# EAGLE board WS2812-Ring_v100 (EAGLE 6.5.0)
CIRCULAR-LAYOUT-SETTINGS: 0.000000 0.000000 3.039370 0.000000 0 1
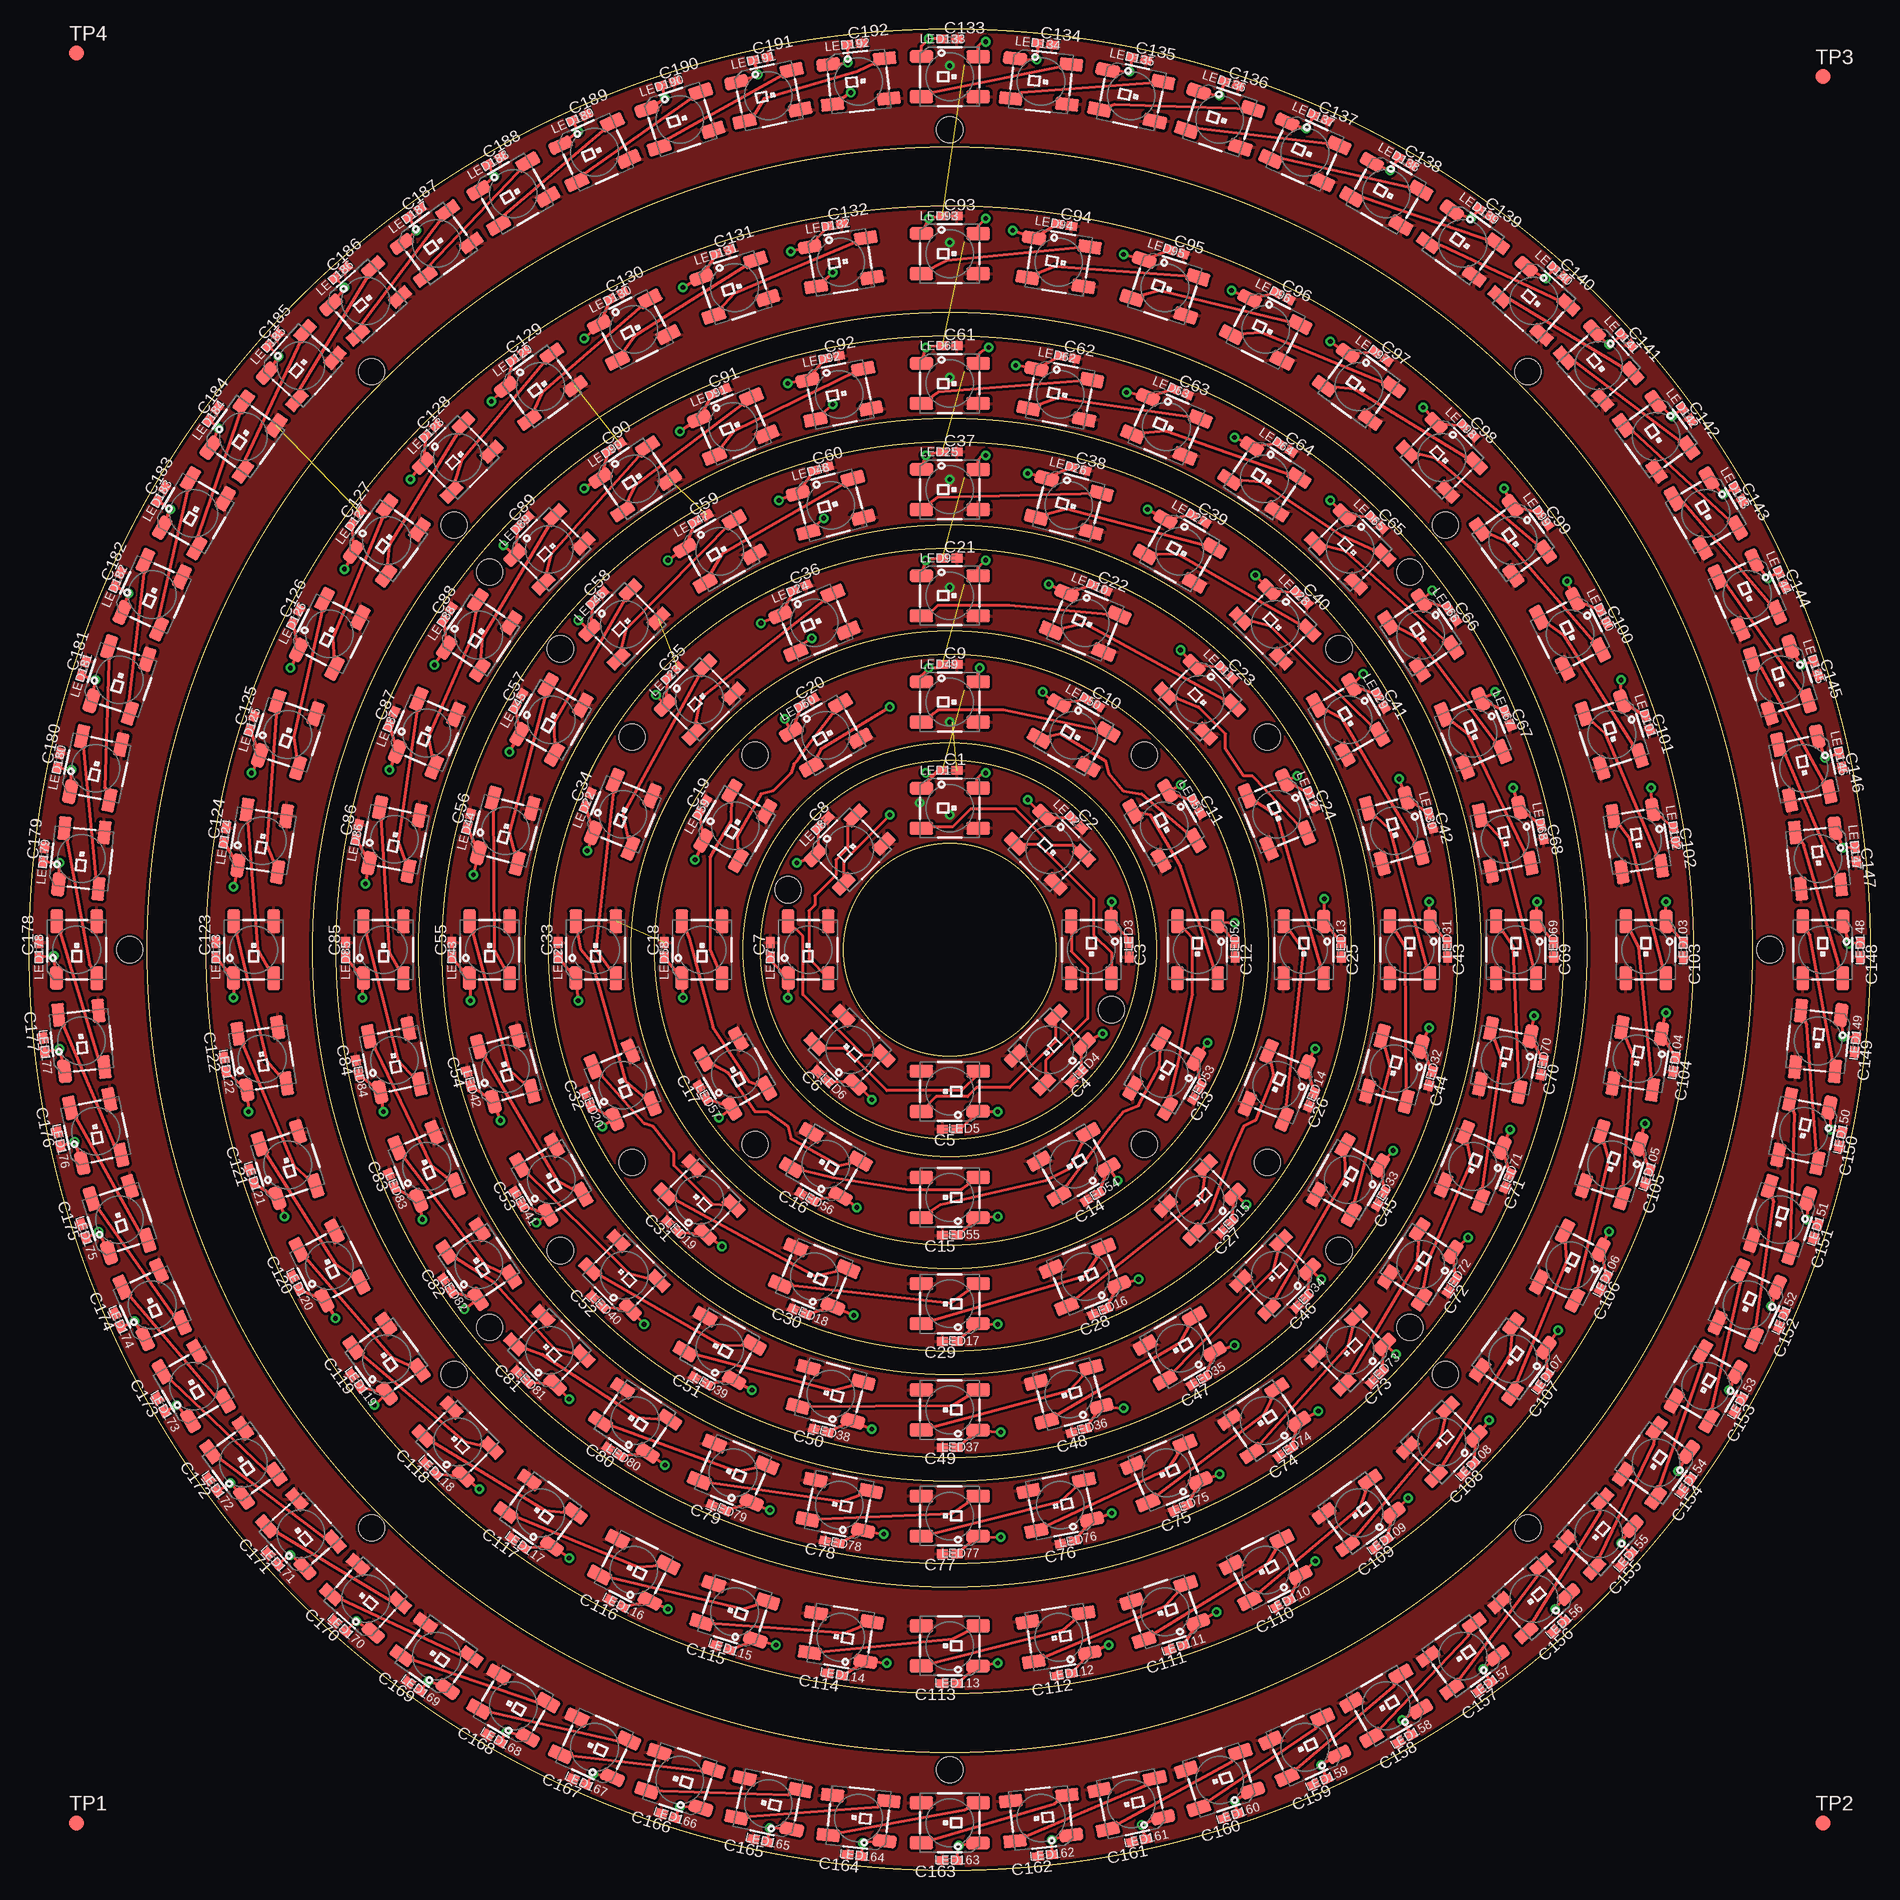
[diagram p2: board, top side]
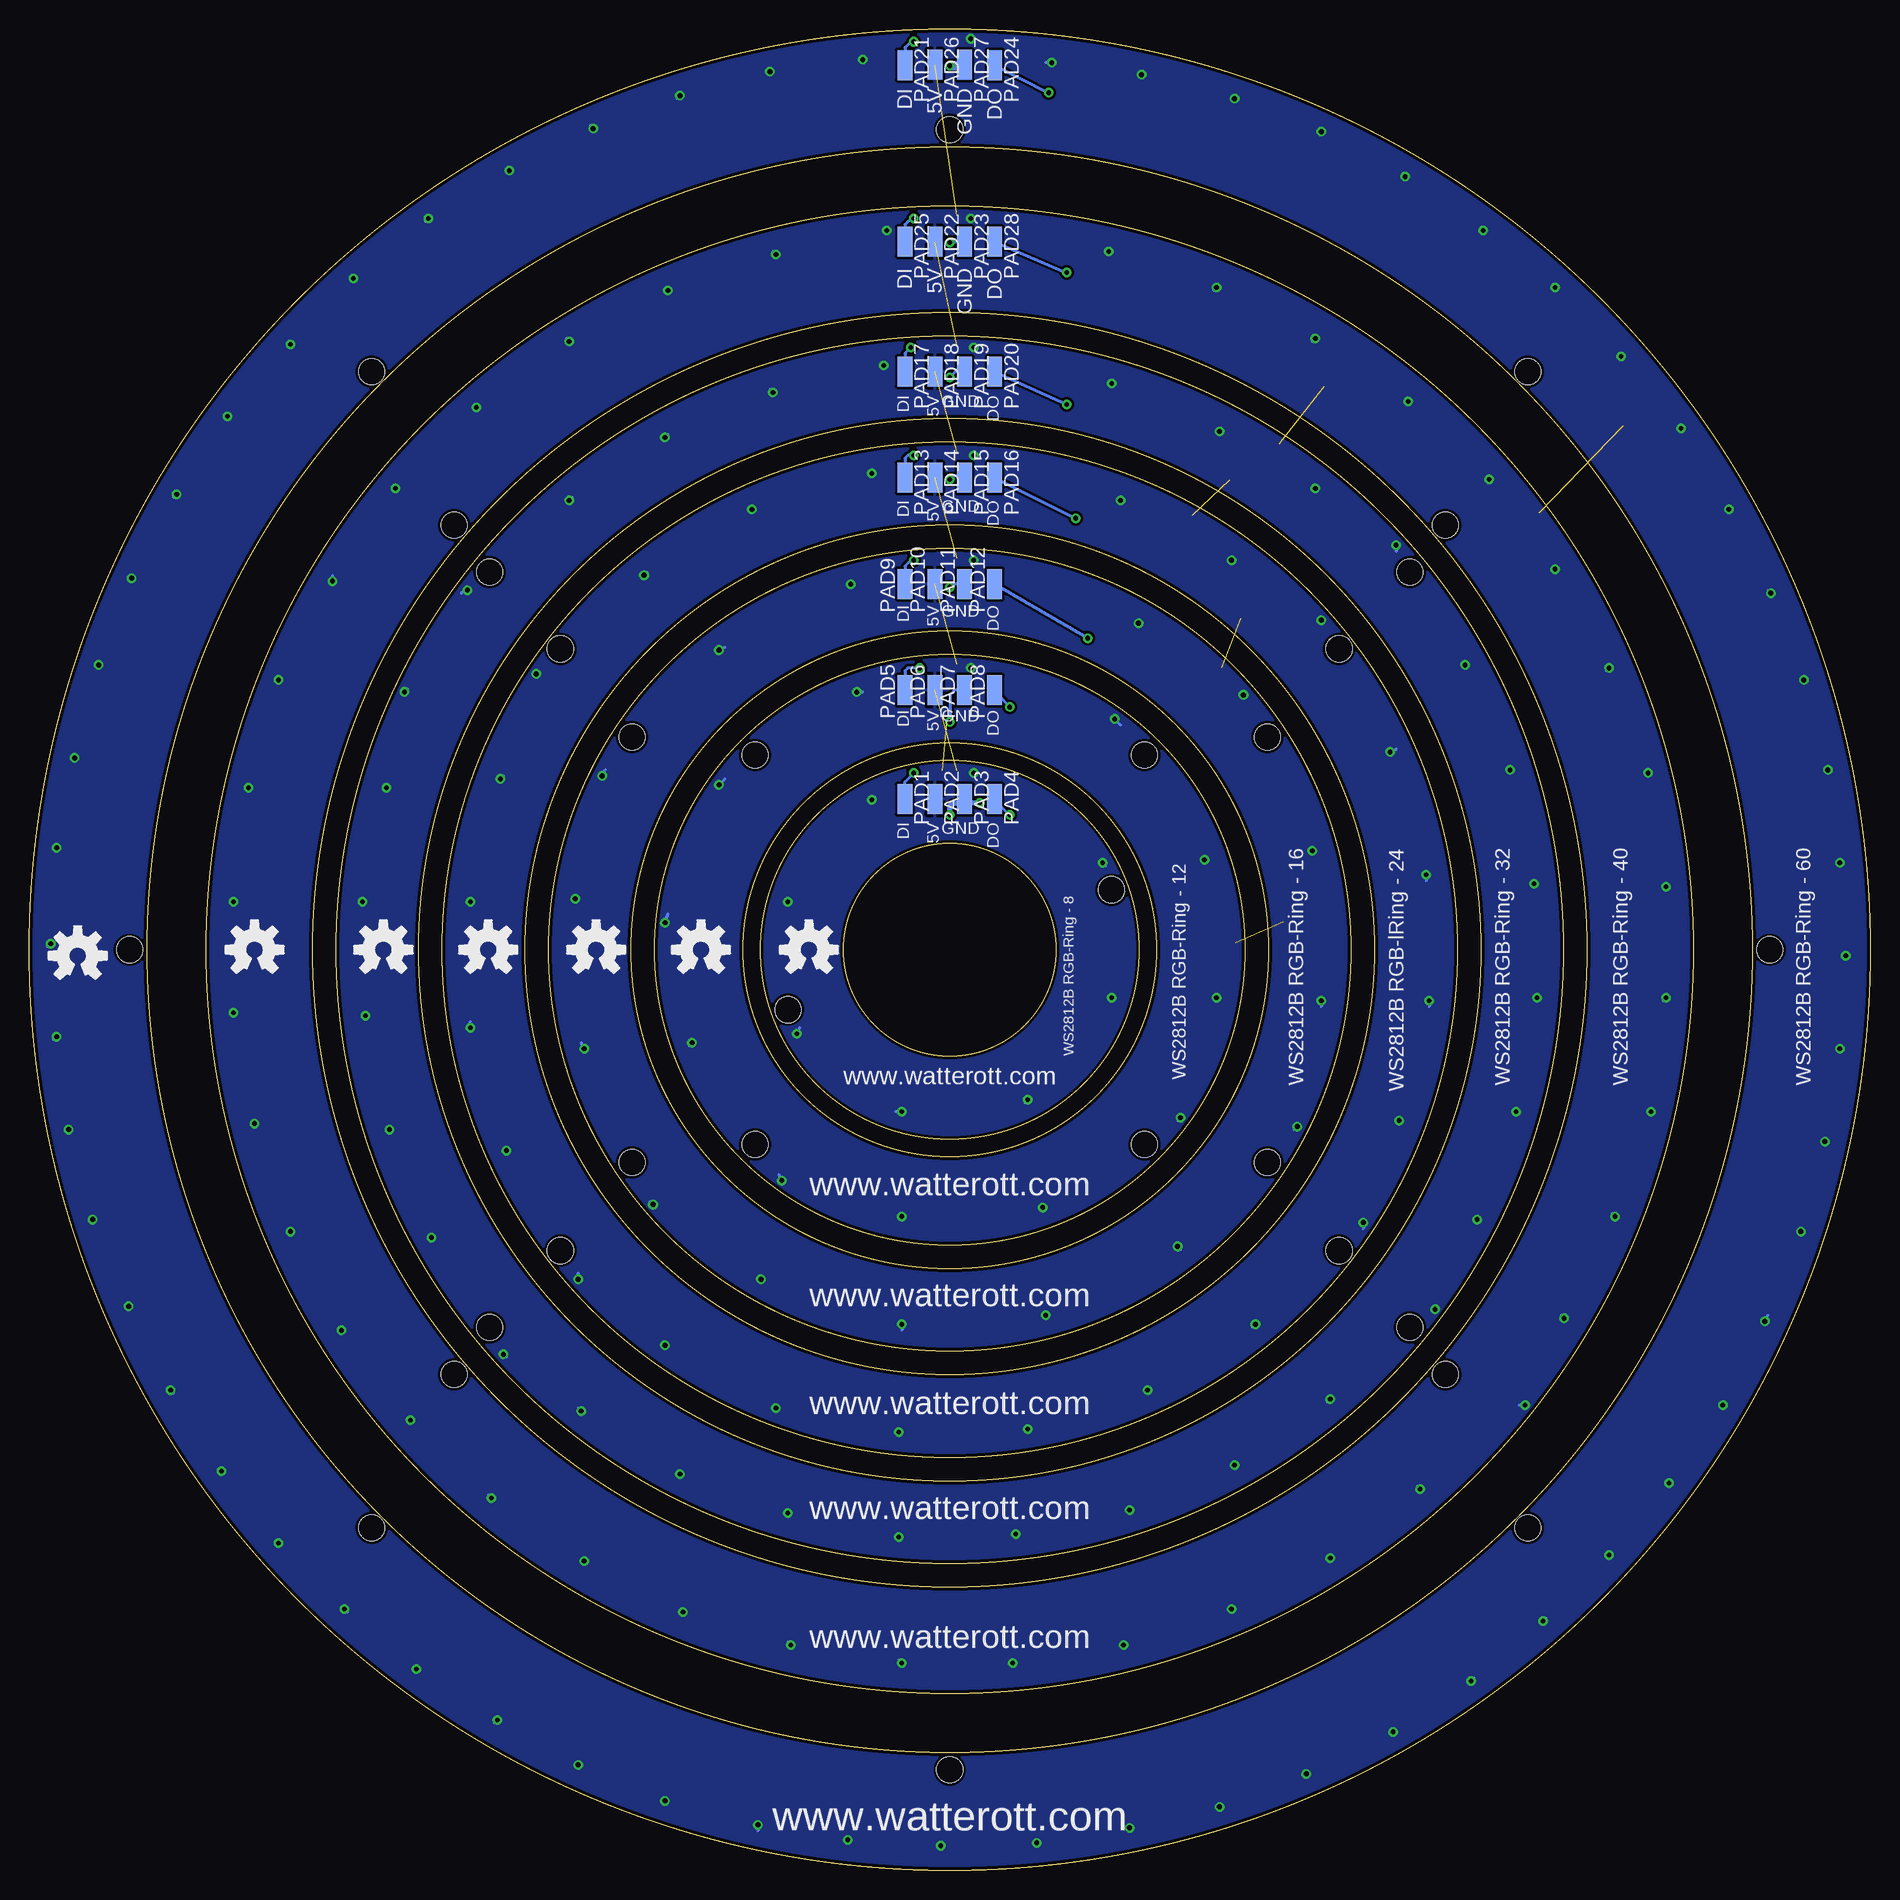
[diagram p3: board, bottom side, seen from below]

Size 156 x 156 mm. Coordinates in mm from the lower left corner, seen from the top.
Outline: circle at 78,78 radius 25
Outline: circle at 78,78 radius 17.5
Outline: circle at 78,78 radius 27
Outline: circle at 78,78 radius 34
Outline: circle at 78,78 radius 36
Outline: circle at 78,78 radius 43
Outline: circle at 78,78 radius 45
Outline: circle at 78,78 radius 52
Outline: circle at 78,78 radius 54
Outline: circle at 78,78 radius 63
Outline: circle at 78,78 radius 16.03
Outline: circle at 78,78 radius 9
Outline: circle at 78,78 radius 68
Outline: circle at 78,78 radius 78
Copper layers (1*16): Top 0.035mm / dielectric 1.5mm / Bottom 0.035mm
Design rules "watterott *": minimum track width 8mil, minimum drill 24mil, track to track 8mil, track to pad 8mil, pad to pad 8mil, via to via 8mil, smd to smd 8mil, copper to edge 10mil, drill to drill 8mil, minimum pad ring 10mil, minimum via ring 8mil, stop-mask expansion 4mil, vias tented up to drill 0.8mm, thermal gap 10mil
Holes 2.2 mm at 91.72,72.92 64.28,83.08 51.08,96.03 104.92,96.03 51.08,59.97 104.92,59.97 61.49,94.51 94.51,94.51 94.51,61.49 61.49,61.49 117,110 117,46 39,110 39,46 8.5,78 147.5,78 78,147.5 78,8.5 29,29 127,127 29,127 127,29 45,52.5 45,103.5 111,103.5 111,52.5 36,42 36,114 120,42 120,114

## Footprints (pad centres in the part's own frame; a part is rotated, then mirrored left to right if it is on the bottom)
C0402K = smd 0.925 x 0.74: 1 -0.6,0; 2 0.6,0
WS2812B = smd 2 x 1.1: 1 -2.4,1.7; 2 -2.4,-1.7; 3 2.4,-1.7; 4 2.4,1.7
SMD1,27-2,54 = smd 1.27 x 2.54: 1 0,0
B1,27 = smd 1.27 x 1.27: TP 0,0

## Placement (x,y rotation side)
C1  100n  [C0402K]  78,93.2 0 top
C2  [C0402K]  88.75,88.75 315 top
C3  [C0402K]  93.2,78 270 top
C4  [C0402K]  88.75,67.25 225 top
C5  [C0402K]  78,62.8 180 top
C6  [C0402K]  67.25,67.25 135 top
C7  [C0402K]  62.8,78 90 top
C8  [C0402K]  67.25,88.75 45 top
C9  [C0402K]  78,102.2 0 top
C10  [C0402K]  90.1,98.96 330 top
C11  [C0402K]  98.96,90.1 300 top
C12  [C0402K]  102.2,78 270 top
C13  [C0402K]  98.96,65.9 240 top
C14  [C0402K]  90.1,57.04 210 top
C15  [C0402K]  78,53.8 180 top
C16  [C0402K]  65.9,57.04 150 top
C17  [C0402K]  57.04,65.9 120 top
C18  [C0402K]  53.8,78 90 top
C19  [C0402K]  57.04,90.1 60 top
C20  [C0402K]  65.9,98.96 30 top
C21  [C0402K]  78,111.2 0 top
C22  [C0402K]  90.71,108.67 337.5 top
C23  [C0402K]  101.48,101.48 315 top
C24  [C0402K]  108.67,90.71 292.5 top
C25  [C0402K]  111.2,78 270 top
C26  [C0402K]  108.67,65.29 247.5 top
C27  [C0402K]  101.48,54.52 225 top
C28  [C0402K]  90.71,47.33 202.5 top
C29  [C0402K]  78,44.8 180 top
C30  [C0402K]  65.29,47.33 157.5 top
C31  [C0402K]  54.52,54.52 135 top
C32  [C0402K]  47.33,65.29 112.5 top
C33  [C0402K]  44.8,78 90 top
C34  [C0402K]  47.33,90.71 67.5 top
C35  [C0402K]  54.52,101.48 45 top
C36  [C0402K]  65.29,108.67 22.5 top
C37  [C0402K]  78,120.2 0 top
C38  [C0402K]  88.92,118.76 345 top
C39  [C0402K]  99.1,114.55 330 top
C40  [C0402K]  107.84,107.84 315 top
C41  [C0402K]  114.55,99.1 300 top
C42  [C0402K]  118.76,88.92 285 top
C43  [C0402K]  120.2,78 270 top
C44  [C0402K]  118.76,67.08 255 top
C45  [C0402K]  114.55,56.9 240 top
C46  [C0402K]  107.84,48.16 225 top
C47  [C0402K]  99.1,41.45 210 top
C48  [C0402K]  88.92,37.24 195 top
C49  [C0402K]  78,35.8 180 top
C50  [C0402K]  67.08,37.24 165 top
C51  [C0402K]  56.9,41.45 150 top
C52  [C0402K]  48.16,48.16 135 top
C53  [C0402K]  41.45,56.9 120 top
C54  [C0402K]  37.24,67.08 105 top
C55  [C0402K]  35.8,78 90 top
C56  [C0402K]  37.24,88.92 75 top
C57  [C0402K]  41.45,99.1 60 top
C58  [C0402K]  48.16,107.84 45 top
C59  [C0402K]  56.9,114.55 30 top
C60  [C0402K]  67.08,118.76 15 top
C61  [C0402K]  78,129.2 0 top
C62  [C0402K]  87.99,128.22 348.8 top
C63  [C0402K]  97.59,125.3 337.5 top
C64  [C0402K]  106.45,120.57 326.3 top
C65  [C0402K]  114.2,114.2 315 top
C66  [C0402K]  120.57,106.45 303.8 top
C67  [C0402K]  125.3,97.59 292.5 top
C68  [C0402K]  128.22,87.99 281.3 top
C69  [C0402K]  129.2,78 270 top
C70  [C0402K]  128.22,68.01 258.8 top
C71  [C0402K]  125.3,58.41 247.5 top
C72  [C0402K]  120.57,49.55 236.3 top
C73  [C0402K]  114.2,41.8 225 top
C74  [C0402K]  106.45,35.43 213.8 top
C75  [C0402K]  97.59,30.7 202.5 top
C76  [C0402K]  87.99,27.78 191.3 top
C77  [C0402K]  78,26.8 180 top
C78  [C0402K]  68.01,27.78 168.8 top
C79  [C0402K]  58.41,30.7 157.5 top
C80  [C0402K]  49.55,35.43 146.3 top
C81  [C0402K]  41.8,41.8 135 top
C82  [C0402K]  35.43,49.55 123.8 top
C83  [C0402K]  30.7,58.41 112.5 top
C84  [C0402K]  27.78,68.01 101.3 top
C85  [C0402K]  26.8,78 90 top
C86  [C0402K]  27.78,87.99 78.8 top
C87  [C0402K]  30.7,97.59 67.5 top
C88  [C0402K]  35.43,106.45 56.3 top
C89  [C0402K]  41.8,114.2 45 top
C90  [C0402K]  49.55,120.57 33.8 top
C91  [C0402K]  58.41,125.3 22.5 top
C92  [C0402K]  68.01,128.22 11.3 top
C93  [C0402K]  78,140.2 0 top
C94  [C0402K]  87.73,139.43 351 top
C95  [C0402K]  97.22,137.16 342 top
C96  [C0402K]  106.24,133.42 333 top
C97  [C0402K]  114.56,128.32 324 top
C98  [C0402K]  121.98,121.98 315 top
C99  [C0402K]  128.32,114.56 306 top
C100  [C0402K]  133.42,106.24 297 top
C101  [C0402K]  137.16,97.22 288 top
C102  [C0402K]  139.43,87.73 279 top
C103  [C0402K]  140.2,78 270 top
C104  [C0402K]  139.43,68.27 261 top
C105  [C0402K]  137.16,58.78 252 top
C106  [C0402K]  133.42,49.76 243 top
C107  [C0402K]  128.32,41.44 234 top
C108  [C0402K]  121.98,34.02 225 top
C109  [C0402K]  114.56,27.68 216 top
C110  [C0402K]  106.24,22.58 207 top
C111  [C0402K]  97.22,18.84 198 top
C112  [C0402K]  87.73,16.57 189 top
C113  [C0402K]  78,15.8 180 top
C114  [C0402K]  68.27,16.57 171 top
C115  [C0402K]  58.78,18.84 162 top
C116  [C0402K]  49.76,22.58 153 top
C117  [C0402K]  41.44,27.68 144 top
C118  [C0402K]  34.02,34.02 135 top
C119  [C0402K]  27.68,41.44 126 top
C120  [C0402K]  22.58,49.76 117 top
C121  [C0402K]  18.84,58.78 108 top
C122  [C0402K]  16.57,68.27 99 top
C123  [C0402K]  15.8,78 90 top
C124  [C0402K]  16.57,87.73 81 top
C125  [C0402K]  18.84,97.22 72 top
C126  [C0402K]  22.58,106.24 63 top
C127  [C0402K]  27.68,114.56 54 top
C128  [C0402K]  34.02,121.98 45 top
C129  [C0402K]  41.44,128.32 36 top
C130  [C0402K]  49.76,133.42 27 top
C131  [C0402K]  58.78,137.16 18 top
C132  [C0402K]  68.27,139.43 9 top
C133  [C0402K]  78,155.2 0 top
C134  [C0402K]  86.07,154.78 354 top
C135  [C0402K]  94.05,153.51 348 top
C136  [C0402K]  101.86,151.42 342 top
C137  [C0402K]  109.4,148.53 336 top
C138  [C0402K]  116.6,144.86 330 top
C139  [C0402K]  123.38,140.46 324 top
C140  [C0402K]  129.66,135.37 318 top
C141  [C0402K]  135.37,129.66 312 top
C142  [C0402K]  140.46,123.38 306 top
C143  [C0402K]  144.86,116.6 300 top
C144  [C0402K]  148.53,109.4 294 top
C145  [C0402K]  151.42,101.86 288 top
C146  [C0402K]  153.51,94.05 282 top
C147  [C0402K]  154.78,86.07 276 top
C148  [C0402K]  155.2,78 270 top
C149  [C0402K]  154.78,69.93 264 top
C150  [C0402K]  153.51,61.95 258 top
C151  [C0402K]  151.42,54.14 252 top
C152  [C0402K]  148.53,46.6 246 top
C153  [C0402K]  144.86,39.4 240 top
C154  [C0402K]  140.46,32.62 234 top
C155  [C0402K]  135.37,26.34 228 top
C156  [C0402K]  129.66,20.63 222 top
C157  [C0402K]  123.38,15.54 216 top
C158  [C0402K]  116.6,11.14 210 top
C159  [C0402K]  109.4,7.47 204 top
C160  [C0402K]  101.86,4.58 198 top
C161  [C0402K]  94.05,2.49 192 top
C162  [C0402K]  86.07,1.22 186 top
C163  [C0402K]  78,0.8 180 top
C164  [C0402K]  69.93,1.22 174 top
C165  [C0402K]  61.95,2.49 168 top
C166  [C0402K]  54.14,4.58 162 top
C167  [C0402K]  46.6,7.47 156 top
C168  [C0402K]  39.4,11.14 150 top
C169  [C0402K]  32.62,15.54 144 top
C170  [C0402K]  26.34,20.63 138 top
C171  [C0402K]  20.63,26.34 132 top
C172  [C0402K]  15.54,32.62 126 top
C173  [C0402K]  11.14,39.4 120 top
C174  [C0402K]  7.47,46.6 114 top
C175  [C0402K]  4.58,54.14 108 top
C176  [C0402K]  2.49,61.95 102 top
C177  [C0402K]  1.22,69.93 96 top
C178  [C0402K]  0.8,78 90 top
C179  [C0402K]  1.22,86.07 84 top
C180  [C0402K]  2.49,94.05 78 top
C181  [C0402K]  4.58,101.86 72 top
C182  [C0402K]  7.47,109.4 66 top
C183  [C0402K]  11.14,116.6 60 top
C184  [C0402K]  15.54,123.38 54 top
C185  [C0402K]  20.63,129.66 48 top
C186  [C0402K]  26.34,135.37 42 top
C187  [C0402K]  32.62,140.46 36 top
C188  [C0402K]  39.4,144.86 30 top
C189  [C0402K]  46.6,148.53 24 top
C190  [C0402K]  54.14,151.42 18 top
C191  [C0402K]  61.95,153.51 12 top
C192  [C0402K]  69.93,154.78 6 top
LED1  WS2812B  [WS2812B]  78,90 0 top
LED2  WS2812B  [WS2812B]  86.49,86.49 315 top
LED3  WS2812B  [WS2812B]  90,78 270 top
LED4  WS2812B  [WS2812B]  86.49,69.51 225 top
LED5  WS2812B  [WS2812B]  78,66 180 top
LED6  WS2812B  [WS2812B]  69.51,69.51 135 top
LED7  WS2812B  [WS2812B]  66,78 90 top
LED8  WS2812B  [WS2812B]  69.51,86.49 45 top
LED9  WS2812B  [WS2812B]  78,108 0 top
LED10  WS2812B  [WS2812B]  89.48,105.72 337.5 top
LED11  WS2812B  [WS2812B]  99.21,99.21 315 top
LED12  WS2812B  [WS2812B]  105.72,89.48 292.5 top
LED13  WS2812B  [WS2812B]  108,78 270 top
LED14  WS2812B  [WS2812B]  105.72,66.52 247.5 top
LED15  WS2812B  [WS2812B]  99.21,56.79 225 top
LED16  WS2812B  [WS2812B]  89.48,50.28 202.5 top
LED17  WS2812B  [WS2812B]  78,48 180 top
LED18  WS2812B  [WS2812B]  66.52,50.28 157.5 top
LED19  WS2812B  [WS2812B]  56.79,56.79 135 top
LED20  WS2812B  [WS2812B]  50.28,66.52 112.5 top
LED21  WS2812B  [WS2812B]  48,78 90 top
LED22  WS2812B  [WS2812B]  50.28,89.48 67.5 top
LED23  WS2812B  [WS2812B]  56.79,99.21 45 top
LED24  WS2812B  [WS2812B]  66.52,105.72 22.5 top
LED25  WS2812B  [WS2812B]  78,117 0 top
LED26  WS2812B  [WS2812B]  88.09,115.67 345 top
LED27  WS2812B  [WS2812B]  97.5,111.77 330 top
LED28  WS2812B  [WS2812B]  105.58,105.58 315 top
LED29  WS2812B  [WS2812B]  111.77,97.5 300 top
LED30  WS2812B  [WS2812B]  115.67,88.09 285 top
LED31  WS2812B  [WS2812B]  117,78 270 top
LED32  WS2812B  [WS2812B]  115.67,67.91 255 top
LED33  WS2812B  [WS2812B]  111.77,58.5 240 top
LED34  WS2812B  [WS2812B]  105.58,50.42 225 top
LED35  WS2812B  [WS2812B]  97.5,44.23 210 top
LED36  WS2812B  [WS2812B]  88.09,40.33 195 top
LED37  WS2812B  [WS2812B]  78,39 180 top
LED38  WS2812B  [WS2812B]  67.91,40.33 165 top
LED39  WS2812B  [WS2812B]  58.5,44.23 150 top
LED40  WS2812B  [WS2812B]  50.42,50.42 135 top
LED41  WS2812B  [WS2812B]  44.23,58.5 120 top
LED42  WS2812B  [WS2812B]  40.33,67.91 105 top
LED43  WS2812B  [WS2812B]  39,78 90 top
LED44  WS2812B  [WS2812B]  40.33,88.09 75 top
LED45  WS2812B  [WS2812B]  44.23,97.5 60 top
LED46  WS2812B  [WS2812B]  50.42,105.58 45 top
LED47  WS2812B  [WS2812B]  58.5,111.77 30 top
LED48  WS2812B  [WS2812B]  67.91,115.67 15 top
LED49  WS2812B  [WS2812B]  78,99 0 top
LED50  WS2812B  [WS2812B]  88.5,96.19 330 top
LED51  WS2812B  [WS2812B]  96.19,88.5 300 top
LED52  WS2812B  [WS2812B]  99,78 270 top
LED53  WS2812B  [WS2812B]  96.19,67.5 240 top
LED54  WS2812B  [WS2812B]  88.5,59.81 210 top
LED55  WS2812B  [WS2812B]  78,57 180 top
LED56  WS2812B  [WS2812B]  67.5,59.81 150 top
LED57  WS2812B  [WS2812B]  59.81,67.5 120 top
LED58  WS2812B  [WS2812B]  57,78 90 top
LED59  WS2812B  [WS2812B]  59.81,88.5 60 top
LED60  WS2812B  [WS2812B]  67.5,96.19 30 top
LED61  WS2812B  [WS2812B]  78,126 0 top
LED62  WS2812B  [WS2812B]  87.36,125.08 348.8 top
LED63  WS2812B  [WS2812B]  96.37,122.35 337.5 top
LED64  WS2812B  [WS2812B]  104.67,117.91 326.3 top
LED65  WS2812B  [WS2812B]  111.94,111.94 315 top
LED66  WS2812B  [WS2812B]  117.91,104.67 303.8 top
LED67  WS2812B  [WS2812B]  122.35,96.37 292.5 top
LED68  WS2812B  [WS2812B]  125.08,87.36 281.3 top
LED69  WS2812B  [WS2812B]  126,78 270 top
LED70  WS2812B  [WS2812B]  125.08,68.64 258.8 top
LED71  WS2812B  [WS2812B]  122.35,59.63 247.5 top
LED72  WS2812B  [WS2812B]  117.91,51.33 236.3 top
LED73  WS2812B  [WS2812B]  111.94,44.06 225 top
LED74  WS2812B  [WS2812B]  104.67,38.09 213.8 top
LED75  WS2812B  [WS2812B]  96.37,33.65 202.5 top
LED76  WS2812B  [WS2812B]  87.36,30.92 191.3 top
LED77  WS2812B  [WS2812B]  78,30 180 top
LED78  WS2812B  [WS2812B]  68.64,30.92 168.8 top
LED79  WS2812B  [WS2812B]  59.63,33.65 157.5 top
LED80  WS2812B  [WS2812B]  51.33,38.09 146.3 top
LED81  WS2812B  [WS2812B]  44.06,44.06 135 top
LED82  WS2812B  [WS2812B]  38.09,51.33 123.8 top
LED83  WS2812B  [WS2812B]  33.65,59.63 112.5 top
LED84  WS2812B  [WS2812B]  30.92,68.64 101.3 top
LED85  WS2812B  [WS2812B]  30,78 90 top
LED86  WS2812B  [WS2812B]  30.92,87.36 78.8 top
LED87  WS2812B  [WS2812B]  33.65,96.37 67.5 top
LED88  WS2812B  [WS2812B]  38.09,104.67 56.3 top
LED89  WS2812B  [WS2812B]  44.06,111.94 45 top
LED90  WS2812B  [WS2812B]  51.33,117.91 33.8 top
LED91  WS2812B  [WS2812B]  59.63,122.35 22.5 top
LED92  WS2812B  [WS2812B]  68.64,125.08 11.3 top
LED93  WS2812B  [WS2812B]  78,137 0 top
LED94  WS2812B  [WS2812B]  87.23,136.27 351 top
LED95  WS2812B  [WS2812B]  96.23,134.11 342 top
LED96  WS2812B  [WS2812B]  104.79,130.57 333 top
LED97  WS2812B  [WS2812B]  112.68,125.73 324 top
LED98  WS2812B  [WS2812B]  119.72,119.72 315 top
LED99  WS2812B  [WS2812B]  125.73,112.68 306 top
LED100  WS2812B  [WS2812B]  130.57,104.79 297 top
LED101  WS2812B  [WS2812B]  134.11,96.23 288 top
LED102  WS2812B  [WS2812B]  136.27,87.23 279 top
LED103  WS2812B  [WS2812B]  137,78 270 top
LED104  WS2812B  [WS2812B]  136.27,68.77 261 top
LED105  WS2812B  [WS2812B]  134.11,59.77 252 top
LED106  WS2812B  [WS2812B]  130.57,51.21 243 top
LED107  WS2812B  [WS2812B]  125.73,43.32 234 top
LED108  WS2812B  [WS2812B]  119.72,36.28 225 top
LED109  WS2812B  [WS2812B]  112.68,30.27 216 top
LED110  WS2812B  [WS2812B]  104.79,25.43 207 top
LED111  WS2812B  [WS2812B]  96.23,21.89 198 top
LED112  WS2812B  [WS2812B]  87.23,19.73 189 top
LED113  WS2812B  [WS2812B]  78,19 180 top
LED114  WS2812B  [WS2812B]  68.77,19.73 171 top
LED115  WS2812B  [WS2812B]  59.77,21.89 162 top
LED116  WS2812B  [WS2812B]  51.21,25.43 153 top
LED117  WS2812B  [WS2812B]  43.32,30.27 144 top
LED118  WS2812B  [WS2812B]  36.28,36.28 135 top
LED119  WS2812B  [WS2812B]  30.27,43.32 126 top
LED120  WS2812B  [WS2812B]  25.43,51.21 117 top
LED121  WS2812B  [WS2812B]  21.89,59.77 108 top
LED122  WS2812B  [WS2812B]  19.73,68.77 99 top
LED123  WS2812B  [WS2812B]  19,78 90 top
LED124  WS2812B  [WS2812B]  19.73,87.23 81 top
LED125  WS2812B  [WS2812B]  21.89,96.23 72 top
LED126  WS2812B  [WS2812B]  25.43,104.79 63 top
LED127  WS2812B  [WS2812B]  30.27,112.68 54 top
LED128  WS2812B  [WS2812B]  36.28,119.72 45 top
LED129  WS2812B  [WS2812B]  43.32,125.73 36 top
LED130  WS2812B  [WS2812B]  51.21,130.57 27 top
LED131  WS2812B  [WS2812B]  59.77,134.11 18 top
LED132  WS2812B  [WS2812B]  68.77,136.27 9 top
LED133  WS2812B  [WS2812B]  78,152 0 top
LED134  WS2812B  [WS2812B]  85.74,151.59 354 top
LED135  WS2812B  [WS2812B]  93.39,150.38 348 top
LED136  WS2812B  [WS2812B]  100.87,148.38 342 top
LED137  WS2812B  [WS2812B]  108.1,145.6 336 top
LED138  WS2812B  [WS2812B]  115,142.09 330 top
LED139  WS2812B  [WS2812B]  121.5,137.87 324 top
LED140  WS2812B  [WS2812B]  127.52,132.99 318 top
LED141  WS2812B  [WS2812B]  132.99,127.52 312 top
LED142  WS2812B  [WS2812B]  137.87,121.5 306 top
LED143  WS2812B  [WS2812B]  142.09,115 300 top
LED144  WS2812B  [WS2812B]  145.6,108.1 294 top
LED145  WS2812B  [WS2812B]  148.38,100.87 288 top
LED146  WS2812B  [WS2812B]  150.38,93.39 282 top
LED147  WS2812B  [WS2812B]  151.59,85.74 276 top
LED148  WS2812B  [WS2812B]  152,78 270 top
LED149  WS2812B  [WS2812B]  151.59,70.26 264 top
LED150  WS2812B  [WS2812B]  150.38,62.61 258 top
LED151  WS2812B  [WS2812B]  148.38,55.13 252 top
LED152  WS2812B  [WS2812B]  145.6,47.9 246 top
LED153  WS2812B  [WS2812B]  142.09,41 240 top
LED154  WS2812B  [WS2812B]  137.87,34.5 234 top
LED155  WS2812B  [WS2812B]  132.99,28.48 228 top
LED156  WS2812B  [WS2812B]  127.52,23.01 222 top
LED157  WS2812B  [WS2812B]  121.5,18.13 216 top
LED158  WS2812B  [WS2812B]  115,13.91 210 top
LED159  WS2812B  [WS2812B]  108.1,10.4 204 top
LED160  WS2812B  [WS2812B]  100.87,7.62 198 top
LED161  WS2812B  [WS2812B]  93.39,5.62 192 top
LED162  WS2812B  [WS2812B]  85.74,4.41 186 top
LED163  WS2812B  [WS2812B]  78,4 180 top
LED164  WS2812B  [WS2812B]  70.26,4.41 174 top
LED165  WS2812B  [WS2812B]  62.61,5.62 168 top
LED166  WS2812B  [WS2812B]  55.13,7.62 162 top
LED167  WS2812B  [WS2812B]  47.9,10.4 156 top
LED168  WS2812B  [WS2812B]  41,13.91 150 top
LED169  WS2812B  [WS2812B]  34.5,18.13 144 top
LED170  WS2812B  [WS2812B]  28.48,23.01 138 top
LED171  WS2812B  [WS2812B]  23.01,28.48 132 top
LED172  WS2812B  [WS2812B]  18.13,34.5 126 top
LED173  WS2812B  [WS2812B]  13.91,41 120 top
LED174  WS2812B  [WS2812B]  10.4,47.9 114 top
LED175  WS2812B  [WS2812B]  7.62,55.13 108 top
LED176  WS2812B  [WS2812B]  5.62,62.61 102 top
LED177  WS2812B  [WS2812B]  4.41,70.26 96 top
LED178  WS2812B  [WS2812B]  4,78 90 top
LED179  WS2812B  [WS2812B]  4.41,85.74 84 top
LED180  WS2812B  [WS2812B]  5.62,93.39 78 top
LED181  WS2812B  [WS2812B]  7.62,100.87 72 top
LED182  WS2812B  [WS2812B]  10.4,108.1 66 top
LED183  WS2812B  [WS2812B]  13.91,115 60 top
LED184  WS2812B  [WS2812B]  18.13,121.5 54 top
LED185  WS2812B  [WS2812B]  23.01,127.52 48 top
LED186  WS2812B  [WS2812B]  28.48,132.99 42 top
LED187  WS2812B  [WS2812B]  34.5,137.87 36 top
LED188  WS2812B  [WS2812B]  41,142.09 30 top
LED189  WS2812B  [WS2812B]  47.9,145.6 24 top
LED190  WS2812B  [WS2812B]  55.13,148.38 18 top
LED191  WS2812B  [WS2812B]  62.61,150.38 12 top
LED192  WS2812B  [WS2812B]  70.26,151.59 6 top
LOGO1  OSHW-LOGOM  [OSHW-LOGO-M]  107.97,78 0 bottom
LOGO2  OSHW-LOGOM  [OSHW-LOGO-M]  117.12,78 0 bottom
LOGO3  OSHW-LOGOM  [OSHW-LOGO-M]  126.01,78 0 bottom
LOGO4  OSHW-LOGOM  [OSHW-LOGO-M]  136.93,78 0 bottom
LOGO5  OSHW-LOGOM  [OSHW-LOGO-M]  151.91,77.49 0 bottom
LOGO6  OSHW-LOGOM  [OSHW-LOGO-M]  89.94,78 0 bottom
LOGO7  OSHW-LOGOM  [OSHW-LOGO-M]  99.08,78 0 bottom
PAD1  [SMD1,27-2,54]  81.81,90.77 180 bottom
PAD2  [SMD1,27-2,54]  79.27,90.77 180 bottom
PAD3  [SMD1,27-2,54]  76.73,90.77 180 bottom
PAD4  [SMD1,27-2,54]  74.19,90.77 180 bottom
PAD5  [SMD1,27-2,54]  81.81,100 0 bottom
PAD6  [SMD1,27-2,54]  79.27,100 0 bottom
PAD7  [SMD1,27-2,54]  76.73,100 0 bottom
PAD8  [SMD1,27-2,54]  74.19,100 0 bottom
PAD9  [SMD1,27-2,54]  81.81,109 0 bottom
PAD10  [SMD1,27-2,54]  79.27,109 0 bottom
PAD11  [SMD1,27-2,54]  76.73,109 0 bottom
PAD12  [SMD1,27-2,54]  74.19,109 0 bottom
PAD13  [SMD1,27-2,54]  81.81,118 180 bottom
PAD14  [SMD1,27-2,54]  79.27,118 180 bottom
PAD15  [SMD1,27-2,54]  76.73,118 180 bottom
PAD16  [SMD1,27-2,54]  74.19,118 180 bottom
PAD17  [SMD1,27-2,54]  81.81,127 180 bottom
PAD18  [SMD1,27-2,54]  79.27,127 180 bottom
PAD19  [SMD1,27-2,54]  76.73,127 180 bottom
PAD20  [SMD1,27-2,54]  74.19,127 180 bottom
PAD21  [SMD1,27-2,54]  81.81,152.99 180 bottom
PAD22  [SMD1,27-2,54]  79.27,138 180 bottom
PAD23  [SMD1,27-2,54]  76.73,138 180 bottom
PAD24  [SMD1,27-2,54]  74.19,152.99 180 bottom
PAD25  [SMD1,27-2,54]  81.81,138.01 180 bottom
PAD26  [SMD1,27-2,54]  79.27,153 180 bottom
PAD27  [SMD1,27-2,54]  76.73,153 180 bottom
PAD28  [SMD1,27-2,54]  74.19,138.01 180 bottom
TP1  TPB1,27  [B1,27]  4,4 0 top
TP2  TPB1,27  [B1,27]  152,4 0 top
TP3  TPB1,27  [B1,27]  152,152 0 top
TP4  TPB1,27  [B1,27]  4,154 0 top

## Tracks (layer width: path | path; a pad name or v marks a point on that pad's centre or on a via)
+5V  (via drill 0.4)  (6 unrouted)
  Top 0.254: LED1.1 77.1,93.2 C1.1 76.94,93.2 76.48,92.73 76.22,92.73 v75.97,92.99 | C8.1 66.83,86.2 LED8.1 66.62,85.92 v65.05,85.37 | C5.1 78.9,62.8 LED5.1 82.05,64.3 v82.06,64.28 | C4.1 89.17,69.8 LED4.1 89.38,70.08 v90.95,70.89 | C3.1 93.2,78.9 LED3.1 91.7,82.05 v91.72,82.06 | C2.1 86.2,89.17 LED2.1 85.92,89.38 v84.6,90.7 | 63.01,76.98 62.8,77.2 C7.1 62.8,77.1 LED7.1 64.3,73.95 v64.28,73.94 | LED6.1 69.8,66.83 C6.1 69.61,66.83 69.62,66.82 69.87,66.82 v71.4,65.3 | C9.1 77.31,102.2 76.98,101.88 v76.22,101.88 75.6,101.25 LED49.1 | v85.87,99.84 86.86,98.86 LED50.1 C10.1 | C21.1 v75.97,111.02 LED9.1 | v64.03,97.56 LED60.1 C20.1 | v56.41,85.62 LED59.1 C19.1 | v55.39,73.94 LED58.1 C18.1 | v58.44,63.78 LED57.1 C17.1 | v70.13,56.16 LED56.1 C16.1 | v82.06,55.39 LED55.1 C15.1 | v92.22,58.44 91.72,59.2 LED54.1 C14.1 | v99.84,70.13 LED53.1 C13.1 | v102.13,80.29 LED52.1 C12.1 | v97.56,91.97 LED51.1 C11.1 | v108.99,69.62 LED14.1 C26.1 | v109.75,82.32 LED13.1 C25.1 | v107.46,92.73 LED12.1 C24.1 | v97.56,103.4 LED11.1 C23.1 | v86.38,108.99 LED10.1 C22.1 | v62,105.69 LED24.1 C36.1 | v53.11,99.59 LED23.1 C35.1 | v47.27,86.38 LED22.1 C34.1 | v46.5,73.68 LED21.1 C33.1 | v48.54,63.01 LED20.1 C32.1 | v58.7,52.85 LED19.1 C31.1 | v69.87,47.01 LED18.1 C30.1 | v82.06,46.25 LED17.1 C29.1 | v94,50.06 LED16.1 C28.1 | v103.15,56.41 LED15.1 C27.1 | v40.66,94.76 LED45.1 C57.1 | v37.61,84.35 LED44.1 C56.1 | v37.36,73.68 LED43.1 C55.1 | v39.9,63.52 LED42.1 C54.1 | v42.95,54.89 LED41.1 C53.1 | v52.09,46.25 LED40.1 C52.1 | v61.24,40.66 LED39.1 C51.1 | v71.4,37.36 LED38.1 C50.1 | v82.32,37.11 LED37.1 C49.1 | v92.73,39.14 LED36.1 C48.1 | v102.13,44.47 LED35.1 C47.1
  Top 0.254: v109.5,50.06 LED34.1 C46.1 | v115.59,60.98 LED33.1 C45.1 | v118.64,71.4 LED32.1 C44.1 | v118.64,82.06 LED31.1 C43.1 | v116.1,92.48 LED30.1 C42.1 | v113.05,101.37 LED29.1 C41.1 | v103.91,109.75 LED28.1 C40.1 | v94.76,115.34 LED27.1 C39.1 | C37.1 v75.97,119.91 LED25.1 | v84.6,118.39 LED26.1 C38.1 | v46.5,105.94 LED46.1 C58.1 | v54.12,111.02 LED47.1 C59.1 | v63.52,116.1 LED48.1 C60.1 | v83.59,127.53 LED62.1 C62.1 | v92.99,125.24 LED63.1 C63.1 | v102.13,121.43 LED64.1 C64.1 | v110.26,116.1 LED65.1 C65.1 | v118.89,108.48 LED66.1 C66.1 | v124.23,99.84 LED67.1 C67.1 | v125.75,91.72 LED68.1 C68.1 | v127.78,82.06 LED69.1 C69.1 | v127.53,72.41 LED70.1 C70.1 | v125.5,62.76 LED71.1 C71.1 | v121.94,53.62 LED72.1 C72.1 | v115.85,43.71 LED73.1 C73.1 | v109.24,38.88 LED74.1 C74.1 | v100.86,33.55 LED75.1 C75.1 | v91.72,30.25 LED76.1 C76.1 | v82.32,28.22 LED77.1 C77.1 | v72.41,28.47 LED78.1 C78.1 | v62.76,30.5 LED79.1 C79.1 | v53.87,34.31 LED80.1 C80.1 | v45.74,39.9 LED81.1 C81.1 | v36.85,47.52 LED82.1 C82.1 | v33.3,55.14 LED83.1 C83.1 | v29.99,64.28 LED84.1 C84.1 | v28.22,73.94 28.22,74.19 LED85.1 C85.1 | v28.47,83.59 LED86.1 C86.1 | v30.5,93.24 LED87.1 C87.1 | v34.31,102.13 LED88.1 C88.1 | v40.15,112.29 LED89.1 C89.1 | v47.01,117.12 LED90.1 C90.1 | v55.14,121.94 LED91.1 C91.1 | v64.28,126.01 LED92.1 C92.1 | C61.1 v75.97,129.05 LED61.1 | v83.33,138.96 LED94.1 C94.1 | v92.73,136.93 LED95.1 C95.1 | v101.88,133.88 LED96.1 C96.1 | v110.26,129.56 LED97.1 C97.1 | v118.13,123.97 LED98.1 C98.1 | v124.99,117.12 LED99.1 C99.1 | v130.32,109.24 LED100.1 C100.1 | v134.9,100.86 134.9,100.35 LED101.1 C101.1 | v137.44,91.72 LED102.1 C102.1 | v138.71,82.06 LED103.1 C103.1
  Top 0.254: v138.71,72.67 LED104.1 C104.1 | v136.93,63.27 LED105.1 C105.1 | v133.88,54.12 LED106.1 C106.1 | v129.56,45.74 LED107.1 C107.1 | v123.72,38.12 LED108.1 C108.1 | v116.86,31.52 LED109.1 C109.1 | v108.99,26.18 LED110.1 C110.1 | v100.61,21.87 LED111.1 C111.1 | v91.46,19.07 LED112.1 C112.1 | v82.06,17.55 LED113.1 C113.1 | v72.67,17.55 LED114.1 C114.1 | v63.27,19.07 LED115.1 C115.1 | v54.12,22.12 LED116.1 C116.1 | v45.74,26.44 LED117.1 C117.1 | v38.12,32.28 LED118.1 C118.1 | v29.23,39.39 LED119.1 C119.1 | v25.93,46.76 LED120.1 C120.1 | v21.61,55.39 LED121.1 C121.1 | v18.56,64.28 LED122.1 C122.1 | v17.29,73.94 LED123.1 C123.1 | v17.29,83.33 LED124.1 C124.1 | v18.82,92.99 LED125.1 C125.1 | v22.12,101.88 LED126.1 C126.1 | v26.69,110.26 LED127.1 C127.1 | v32.28,117.88 LED128.1 C128.1 | v39.14,124.48 LED129.1 C129.1 | v47.01,129.82 LED130.1 C130.1 | v55.39,134.13 LED131.1 C131.1 | v64.54,137.18 LED132.1 C132.1 | C93.1 v76.22,139.98 LED93.1 | LED191.1 v61.74,152.17 C191.1 | LED192.1 v69.36,153.18 C192.1 | LED135.1 v93.24,152.42 C135.1 | LED134.1 v85.37,153.44 C134.1 | LED136.1 v100.86,150.39 C136.1 | LED137.1 v108.23,147.6 C137.1 | LED138.1 v115.34,144.04 C138.1 | LED139.1 v122.2,139.98 C139.1 | LED140.1 v128.55,134.9 C140.1 | LED141.1 v133.88,129.31 C141.1 | LED142.1 v139.21,123.21 C142.1 | LED143.1 v143.53,116.61 C143.1 | LED144.1 v147.34,109.5 C144.1 | LED145.1 v150.14,102.13 C145.1 | LED146.1 v152.17,94.26 C146.1 | LED147.1 v153.69,86.64 C147.1 | LED148.1 v154.2,78.51 C148.1 | LED149.1 v153.69,70.63 C149.1 | LED150.1 v152.68,62.76 C150.1 | LED151.1 v150.64,55.14 C151.1 | LED152.1 v147.6,47.77 C152.1 | LED153.1 v144.04,40.66 C153.1 | LED154.1 v139.72,33.8 C154.1
  Top 0.254: LED155.1 v134.9,27.71 C155.1 | LED156.1 v129.31,22.12 C156.1 | LED157.1 v123.21,17.04 C157.1 | LED158.1 v116.35,12.72 C158.1 | C159.1 v109.5,8.91 LED159.1 | LED160.1 v102.13,5.86 C160.1 | LED161.1 v94.26,3.83 C161.1 | LED162.1 v86.64,2.56 C162.1 | LED163.1 v78.76,2.05 C163.1 | LED164.1 v70.63,2.31 C164.1 | LED165.1 v62.76,3.58 C165.1 | LED166.1 v55.14,5.36 C166.1 | LED167.1 v47.77,8.15 C167.1 | LED168.1 v40.41,11.71 C168.1 | LED169.1 v33.8,16.02 C169.1 | LED170.1 v27.71,21.1 C170.1 | LED171.1 v22.12,26.69 C171.1 | LED172.1 v17.04,32.79 C172.1 | LED173.1 v12.47,39.39 C173.1 | LED174.1 v8.91,46.5 C174.1 | LED175.1 v5.86,54.12 C175.1 | LED176.1 v3.83,61.74 C176.1 | LED177.1 v2.56,69.62 C177.1 | LED178.1 v2.05,77.49 C178.1 | LED179.1 v2.56,85.37 C179.1 | LED180.1 v3.58,93.24 C180.1 | LED181.1 v5.61,100.86 C181.1 | LED182.1 v8.4,108.23 C182.1 | LED183.1 v11.96,115.34 C183.1 | LED184.1 v16.02,122.2 C184.1 | LED185.1 v21.1,128.29 C185.1 | LED186.1 v26.69,134.13 C186.1 | LED187.1 v32.79,138.96 C187.1 | LED188.1 v39.39,143.53 C188.1 | LED189.1 v46.5,147.34 C189.1 | LED190.1 v53.87,150.14 C190.1 | C133.1 76.24,155.2 v76.22,155.22 75.6,154.59 LED133.1
  Bottom 0.254: v65.05,85.37 64.79,85.11 | v64.28,73.94 64.28,73.68 | v82.06,64.28 82.57,64.28 | v90.95,70.89 90.7,71.4 | v91.72,82.06 91.72,82.32 | v84.6,90.7 84.35,90.95 | v75.97,92.99 75.71,92.99 | v71.4,65.3 71.65,65.05 | v85.87,99.84 85.37,99.84 | v75.97,111.02 75.71,111.02 | v64.03,97.56 63.52,97.05 | v56.41,85.62 56.66,85.62 | v55.39,73.94 55.39,73.68 | v58.44,63.78 58.7,63.52 | v70.13,56.16 70.38,56.16 | v82.06,55.39 82.32,55.39 | v92.22,58.44 92.48,58.95 | v99.84,70.13 100.1,69.87 | v102.13,80.29 101.88,81.05 | v97.56,91.97 97.05,92.48 | v108.99,69.62 109.24,70.13 | v109.75,82.32 109.75,82.57 | v107.46,92.73 107.21,93.24 | v97.56,103.4 97.05,103.65 | v86.38,108.99 86.13,108.99 | v62,105.69 62,105.43 | v53.11,99.59 52.85,99.59 | v47.27,86.38 47.27,86.13 | v46.5,73.68 46.5,73.17 | v48.54,63.01 48.79,62.76 | v58.7,52.85 58.44,52.6 | v69.87,47.01 69.62,47.01 | v82.06,46.25 82.06,45.74 | v94,50.06 94.26,50.06 | v103.15,56.41 103.4,56.66 | v40.66,94.76 40.15,95.02 | v37.61,84.35 37.61,83.84 | v37.36,73.68 37.36,73.17 | v39.9,63.52 39.9,63.27 | v42.95,54.89 42.95,54.38 | v52.09,46.25 52.35,46 | v61.24,40.66 61.49,40.66 | v71.4,37.36 71.65,37.36 | v82.32,37.11 82.57,37.11 | v92.73,39.14 92.73,39.39 | v109.5,50.06 109.5,50.57 | v115.59,60.98 115.85,60.98 | v118.64,71.4 118.64,71.9 | v118.64,82.06 118.64,82.32 | v116.1,92.48 115.85,92.73 | v113.05,101.37 112.8,101.37 | v103.91,109.75 103.65,110 | v94.76,115.34 94.51,115.34 | v75.97,119.91 75.71,119.91 | v84.6,118.39 84.6,118.64 | v46.5,105.94 46.5,105.69 | v54.12,111.02 54.12,110.77 | v63.52,116.1 63.27,116.1 | v92.99,125.24 93.24,125.5 | v102.13,121.43 101.88,121.69 | v110.26,116.1 110,116.35 | v118.89,108.48 119.4,108.23
  Bottom 0.254: v124.23,99.84 123.97,100.1 | v125.75,91.72 125.75,91.97 | v127.78,82.06 127.78,82.32 | v127.53,72.41 127.78,72.41 | v125.5,62.76 125.75,62.76 | v121.94,53.62 121.94,53.87 | v115.85,43.71 115.59,43.46 | v109.24,38.88 109.5,39.14 | v100.86,33.55 101.11,33.55 | v91.72,30.25 91.97,30.25 | v82.32,28.22 82.57,28.22 | v72.41,28.47 72.67,28.47 | v62.76,30.5 63.01,30.5 | v45.74,39.9 46,39.65 | v33.3,55.14 33.3,54.89 | v29.99,64.28 29.74,64.28 | v28.22,73.94 28.22,73.68 | v28.47,83.59 28.22,83.59 | v34.31,102.13 34.06,102.13 | v40.15,112.29 40.15,111.78 | v47.01,117.12 47.01,117.37 | v55.14,121.94 55.14,122.2 | v64.28,126.01 64.03,126.01 | v75.97,129.05 75.71,128.8 | v83.33,138.96 83.59,138.96 | v92.73,136.93 92.99,137.18 | v101.88,133.88 101.88,134.13 | v110.26,129.56 110.51,129.82 | v118.13,123.97 118.13,124.23 | v124.99,117.12 124.99,117.37 | v130.32,109.24 130.32,109.75 | v138.71,82.06 138.71,82.32 | v138.71,72.67 138.71,72.92 | v129.56,45.74 129.31,45.74 | v123.72,38.12 123.72,38.38 | v116.86,31.52 117.12,31.77 | v108.99,26.18 108.99,26.44 | v100.61,21.87 100.61,22.12 | v91.46,19.07 91.72,19.33 | v82.06,17.55 82.32,17.8 | v72.67,17.55 72.92,17.55 | v63.27,19.07 63.27,19.33 | v54.12,22.12 54.38,22.12 | v45.74,26.44 45.74,26.69 | v38.12,32.28 38.38,32.53 | v29.23,39.39 29.74,39.39 | v25.93,46.76 26.18,47.01 | v21.61,55.39 21.87,55.65 | v18.56,64.28 18.82,64.28 | v17.29,73.94 17.55,73.68 | v17.29,83.33 17.55,83.33 | v18.82,92.99 19.07,92.99 | v22.12,101.88 22.37,101.62 | v26.69,110.26 26.95,110.26 | v32.28,117.88 32.28,117.62 | v39.14,124.48 39.39,124.48 | v47.01,129.82 47.27,129.56 | v55.39,134.13 55.65,133.88 | v64.54,137.18 64.54,136.93 | v76.22,139.98 75.97,139.98
  Bottom 0.254: v61.74,152.17 62,152.17 | v69.36,153.18 69.87,153.18 | v93.24,152.42 93.49,152.42 | v85.37,153.44 85.62,153.44 | v100.86,150.39 101.11,150.14 | v108.23,147.6 108.48,147.85 | v115.34,144.04 115.59,144.04 | v122.2,139.98 122.45,139.72 | v128.55,134.9 128.55,134.64 | v133.88,129.31 134.13,129.31 | v139.21,123.21 139.21,122.96 | v143.53,116.61 143.79,116.35 | v147.34,109.5 147.34,109.24 | v150.14,102.13 150.14,101.88 | v152.17,94.26 152.42,94.26 | v153.69,86.64 153.69,86.38 | v154.2,78.51 154.45,78.25 | v153.69,70.63 153.95,70.38 | v152.68,62.76 152.68,62.51 | v150.64,55.14 150.64,54.89 | v147.6,47.77 147.6,47.52 | v144.04,40.66 143.79,40.41 | v139.72,33.8 139.72,33.55 | v134.9,27.71 134.9,27.45 | v129.31,22.12 129.05,21.87 | v123.21,17.04 122.96,17.04 | v116.35,12.72 116.61,12.47 | v109.5,8.91 109.5,9.17 | v102.13,5.86 101.88,5.86 | v94.26,3.83 94.26,3.32 | v86.64,2.56 86.38,2.56 | v78.76,2.05 78.51,2.05 | v62.76,3.58 62.51,3.58 | v47.77,8.15 47.52,8.15 | v33.8,16.02 33.55,16.28 | v27.71,21.1 27.45,21.36 | v22.12,26.69 21.87,26.69 | v17.04,32.79 16.79,32.79 | v12.47,39.39 12.47,39.65 | v8.91,46.5 8.66,47.01 | v5.86,54.12 5.86,54.38 | v3.83,61.74 3.83,62 | v2.56,69.62 2.56,69.87 | v2.05,77.49 1.8,77.49 | v2.56,85.37 2.56,85.62 | v3.58,93.24 3.58,93.49 | v5.61,100.86 5.61,101.11 | v8.4,108.23 8.66,108.48 | v11.96,115.34 12.21,115.34 | v16.02,122.2 16.28,122.2 | v21.1,128.29 21.36,128.29 | v26.69,134.13 26.95,134.13 | v32.79,138.96 33.04,138.96 | v39.39,143.53 39.65,143.53 | v46.5,147.34 46.76,147.34 | v53.87,150.14 54.12,150.14 | v76.22,155.22 75.97,155.22
  pour Bottom: 0,0 156,0 156,156 0,156
GND  (via drill 0.4)  (6 unrouted)
  Top 0.254: v78,97.3 78.25,97.3 | v78,108.73 78,108.48 | v78,126.51 78,126.77 | v78,117.88 78,117.37 | v78,137.94 78,137.69 | v78,152.93 78,152.68
  Top 0.406: C59.2 arc-90 57.66,115.08 57.68,115.08 arc90 57.43,114.83
  Bottom 0.254: PAD7.1 77.59,100 78,99.59 v78,97.3 | PAD11.1 77.73,109 v78,108.73 | PAD19.1 77.51,127 v78,126.51 | PAD15.1 76.86,118 | 76.86,118 76.98,117.88 | 76.86,118 76.73,118.13 77.75,118.13 v78,117.88 | PAD23.1 v78,137.94
  Bottom 0.406: v75.46,90.45 76.41,90.45 PAD3.1 | v78,89.43 78,90.19 77.75,90.45 76.73,90.45 | 76.73,90.95 PAD3.1 | 76.73,90.45 76.73,90.19 | 76.73,90.45 PAD3.1 | 76.73,91.21 PAD3.1
  Bottom 0.61: PAD27.1 76.73,152.93
  Bottom 0.813: 76.73,152.93 v78,152.93
  pour Top: 0,0 156,0 156,156 0,156
N$1
  Top 0.254: LED2.4 88.48,86.89 86.64,86.89 83.59,89.94 79.78,89.94 78.25,88.41 75.71,88.41 LED1.2
N$2
  Top 0.254: LED2.2 85.53,86.98 90.19,82.32 90.19,79.27 91.72,77.75 91.72,75.62 LED3.4
N$3
  Top 0.254: LED3.2 88.3,77.86 89.68,76.48 89.68,72.16 86.13,68.6 86.13,66.75 LED4.4
N$4
  Top 0.254: LED4.2 86.98,70.22 83.08,66.32 80.29,66.32 79.52,65.55 76.85,65.55 LED5.4
N$5
  Top 0.254: LED5.2 80.4,67.45 79.02,66.06 72.67,66.06 69.11,69.62 67.01,69.62 LED6.4
N$6
  Top 0.254: LED6.2 70.72,69.02 65.55,74.19 65.55,79.15 LED7.4
N$7
  Top 0.254: LED7.2 66.06,77.24 66.06,81.3 66.57,81.81 66.57,82.57 68.35,84.35 68.35,85.62 69.36,86.64 69.36,88.74 LED8.4
N$8
  Top 0.254: LED9.2 76.07,106.3 76.98,107.21 83.08,107.21 LED10.4
N$9
  Top 0.254: LED10.2 89.43,105.69 LED11.4
N$10
  Top 0.254: LED11.2 99.08,98.57 101.37,96.29 101.37,95.02 102.89,92.73 103.65,92.73 103.91,92.48 LED12.4
N$11
  Top 0.254: LED12.2 105.69,89.43 LED13.4
N$12
  Top 0.254: LED13.2 107.97,78 LED14.4
N$13
  Top 0.254: LED14.2 105.43,67.33 103.91,63.52 102.89,63.01 101.88,60.73 100.1,55.9 LED15.4
N$14
  Top 0.254: LED15.2 99.34,56.92 LED16.4
N$15
  Top 0.254: LED17.2 78,48.03 LED18.4
N$16
  Top 0.254: LED18.2 66.57,50.31 LED19.4
N$17
  Top 0.254: LED19.2 57.93,56.41 54.63,59.71 54.63,60.73 52.85,63.01 52.09,63.27 LED20.4
N$18
  Top 0.254: LED20.2 50.57,66.82 47.77,76.73 46.76,78 LED21.4
N$19
  Top 0.254: LED21.2 48.03,78 LED22.4
N$20
  Top 0.254: LED22.2 50.31,89.43 LED23.4
N$21
  Top 0.254: LED23.2 56.92,99.34 LED24.4
N$22
  Top 0.254: LED16.2 89.43,50.31 LED17.4
N$23
  Top 0.254: LED25.2 76.98,116.35 LED26.4
N$24
  Top 0.254: LED27.4 87.91,115.34 LED26.2
N$25
  Top 0.254: LED28.4 97.3,111.53 LED27.2
N$26
  Top 0.254: LED29.4 105.18,105.43 LED28.2
N$27
  Top 0.254: LED30.4 111.27,97.56 LED29.2
N$28
  Top 0.254: LED31.4 115.34,88.16 LED30.2
N$29
  Top 0.254: LED32.4 116.61,78.25 LED31.2
N$30
  Top 0.254: LED34.4 111.53,58.7 LED33.2
N$31
  Top 0.254: LED35.4 105.43,50.82 LED34.2
N$32
  Top 0.254: LED36.4 97.56,44.73 LED35.2
N$33
  Top 0.254: LED37.4 88.16,40.66 LED36.2
N$34
  Top 0.254: LED38.4 78.25,39.39 LED37.2
N$35
  Top 0.254: LED39.4 68.09,40.66 LED38.2
N$36
  Top 0.254: LED40.4 58.7,44.47 LED39.2
N$37
  Top 0.254: LED33.4 115.34,68.09 LED32.2
N$38
  Top 0.254: LED42.4 44.73,58.44 LED41.2
N$39
  Top 0.254: LED43.4 40.66,67.84 LED42.2
N$40
  Top 0.254: LED44.4 39.39,78 LED43.2
N$41
  Top 0.254: LED45.4 40.66,87.91 LED44.2
N$42
  Top 0.254: LED46.4 44.47,97.3 LED45.2
N$43
  Top 0.254: LED47.4 50.57,105.18 LED46.2
N$44
  Top 0.254: LED48.4 58.7,111.53 LED47.2
N$45
  Top 0.254: LED41.4 50.82,50.57 LED40.2
N$46
  Top 0.254: LED50.4 82.57,98.32 76.98,98.32 LED49.2
N$47
  Top 0.254: LED50.2 87.4,96.29 91.21,94 91.46,92.99 92.73,91.46 94.26,91.21 LED51.4
N$48
  Top 0.254: LED52.4 97.56,85.11 95.02,89.43 LED51.2
N$49
  Top 0.254: LED53.4 97.3,68.09 98.57,74.19 98.57,79.02 LED52.2
N$50
  Top 0.254: LED54.4 88.41,58.7 91.46,62.76 92.73,64.28 94,64.79 95.78,68.09 LED53.2
N$51
  Top 0.254: LED55.4 77.24,56.41 86.13,58.44 88.16,59.46 LED54.2
N$52
  Top 0.254: LED56.4 68.09,58.7 74.44,57.68 79.02,57.68 LED55.2
N$53
  Top 0.254: LED58.4 55.9,79.02 57.93,71.4 60.98,66.82 LED57.2
N$54
  Top 0.254: LED59.4 59.46,89.68 59.46,88.92 57.68,85.87 57.68,78 LED58.2
N$55
  Top 0.254: 59.97,85.69 LED59.2 59.97,87.65 62,91.21 63.01,91.46 64.54,92.99 64.79,93.75 65.05,94 65.55,94.76 LED60.4
N$56  (via drill 0.4)
  Top 0.254: v81.05,92.99 80.79,92.99 80.29,92.48 80.29,91.81 LED1.4
  Bottom 0.254: PAD1.1 81.81,92.22 v81.05,92.99
N$57
  Top 0.254: LED57.4 59.2,67.59 60.98,65.05 61.49,64.28 62.51,64.28 64.28,63.01 64.54,62 68.6,59.71 LED56.2
N$58
  Top 0.254: LED62.4 76.98,125.24 LED61.2
N$59
  Top 0.254: LED63.4 87.14,124.74 LED62.2
N$60
  Top 0.254: LED64.4 96.29,121.94 LED63.2
N$61
  Top 0.254: LED65.4 111.27,113.05 104.42,117.62 LED64.2
N$62
  Top 0.254: LED66.4 111.53,111.78 LED65.2
N$63
  Top 0.254: LED67.4 117.62,104.42 LED66.2
N$64
  Top 0.254: LED68.4 121.94,96.29 LED67.2
N$65
  Top 0.254: LED70.4 125.75,78.25 LED69.2
N$66
  Top 0.254: LED71.4 124.74,68.86 LED70.2
N$67
  Top 0.254: LED72.4 118.64,51.84 122.2,59.97 LED71.2
N$68
  Top 0.254: LED73.4 117.62,51.58 LED72.2
N$69
  Top 0.254: LED74.4 111.78,44.47 LED73.2
N$70
  Top 0.254: LED75.4 104.67,38.63 LED74.2
N$71
  Top 0.254: LED76.4 96.54,34.06 LED75.2
N$72
  Top 0.254: LED69.4 124.74,87.4 LED68.2
N$73
  Top 0.254: LED78.4 78.25,30.25 LED77.2
N$74
  Top 0.254: LED79.4 68.86,31.26 LED78.2
N$75
  Top 0.254: LED80.4 59.97,33.8 LED79.2
N$76
  Top 0.254: LED81.4 43.46,43.71 51.58,38.38 LED80.2
N$77
  Top 0.254: LED81.2 44.47,44.22 39.39,49.81 LED82.4
N$78
  Top 0.254: LED83.4 38.63,51.33 LED82.2
N$79
  Top 0.254: LED84.4 34.06,59.71 LED83.2
N$80
  Top 0.254: LED77.4 87.4,31.26 LED76.2
N$81
  Top 0.254: LED86.4 30.5,77.75 LED85.2
N$82
  Top 0.254: LED87.4 31.26,87.14 LED86.2
N$83
  Top 0.254: LED88.4 37.36,104.16 33.8,96.03 LED87.2
N$84
  Top 0.254: LED89.4 38.38,104.42 LED88.2
N$85
  Top 0.254: LED90.4 44.22,111.53 LED89.2
N$86
  Top 0.254: LED91.4 51.33,117.37 LED90.2
N$87
  Top 0.254: LED92.4 70.13,127.02 59.71,121.94 LED91.2
N$88
  Top 0.254: LED85.4 31.26,68.6 LED84.2
N$89
  Top 0.254: LED94.4 77.75,136.42 LED93.2
N$90
  Top 0.254: LED95.4 86.89,135.91 LED94.2
N$91
  Top 0.254: LED96.4 95.78,133.88 LED95.2
N$92
  Top 0.254: LED97.4 104.42,130.32 LED96.2
N$93
  Top 0.254: LED98.4 112.29,125.5 LED97.2
N$94
  Top 0.254: LED99.4 119.15,119.66 LED98.2
N$95
  Top 0.254: LED100.4 125.24,112.54 LED99.2
N$96
  Top 0.254: LED102.4 133.63,96.29 LED101.2
N$97
  Top 0.254: LED103.4 135.66,87.4 LED102.2
N$98
  Top 0.254: LED104.4 136.42,78.25 LED103.2
N$99
  Top 0.254: LED105.4 135.91,69.11 LED104.2
N$100
  Top 0.254: LED106.4 133.88,60.22 LED105.2
N$101
  Top 0.254: LED107.4 130.32,51.58 LED106.2
N$102
  Top 0.254: LED108.4 125.5,43.71 LED107.2
N$103
  Top 0.254: LED101.4 130.07,104.67 LED100.2
N$104
  Top 0.254: LED110.4 112.8,30.76 LED109.2
N$105
  Top 0.254: LED111.4 104.92,25.93 LED110.2
N$106
  Top 0.254: LED112.4 96.29,22.37 LED111.2
N$107
  Top 0.254: LED113.4 87.65,20.34 LED112.2
N$108
  Top 0.254: LED114.4 78.25,19.58 LED113.2
N$109
  Top 0.254: LED115.4 69.11,20.09 LED114.2
N$110
  Top 0.254: LED116.4 60.47,22.12 LED115.2
N$111
  Top 0.254: LED109.4 119.66,36.85 LED108.2
N$112
  Top 0.254: LED118.4 43.71,30.5 LED117.2
N$113
  Top 0.254: LED119.4 36.85,36.34 LED118.2
N$114
  Top 0.254: LED120.4 30.76,43.46 LED119.2
N$115
  Top 0.254: LED121.4 25.93,51.33 LED120.2
N$116
  Top 0.254: LED122.4 22.37,59.71 LED121.2
N$117
  Top 0.254: LED123.4 20.09,68.6 LED122.2
N$118
  Top 0.254: LED124.4 19.33,78 LED123.2
N$119
  Top 0.254: LED117.4 51.58,25.68 LED116.2
N$120
  Top 0.254: LED126.4 22.37,96.03 LED125.2
N$121
  Top 0.254: LED127.4 25.68,104.42 LED126.2
N$122
  Top 0.254: LED128.4 30.5,112.29 LED127.2
N$123
  Top 0.254: LED129.4 36.6,119.4 LED128.2
N$124
  Top 0.254: LED130.4 43.46,125.24 LED129.2
N$125
  Top 0.254: LED131.4 51.33,130.07 LED130.2
N$126
  Top 0.254: LED132.4 59.71,133.63 LED131.2
N$127
  Top 0.254: LED125.4 20.09,86.89 LED124.2
N$128
  Top 0.254: LED134.4 76.48,150.64 LED133.2
N$129
  Top 0.254: LED135.4 84.1,150.64 LED134.2
N$130
  Top 0.254: LED136.4 91.97,149.63 LED135.2
N$131
  Top 0.254: LED137.4 99.08,147.6 LED136.2
N$132
  Top 0.254: LED138.4 106.19,145.06 LED137.2
N$133
  Top 0.254: LED139.4 113.05,141.75 LED138.2
N$134
  Top 0.254: LED140.4 119.66,137.69 LED139.2
N$135
  Top 0.254: LED142.4 131.09,127.78 LED141.2
N$136
  Top 0.254: LED143.4 135.91,121.94 LED142.2
N$137
  Top 0.254: LED144.4 140.23,115.85 LED143.2
N$138
  Top 0.254: LED145.4 143.79,108.99 LED144.2
N$139
  Top 0.254: LED146.4 146.83,101.88 LED145.2
N$140
  Top 0.254: LED147.4 148.87,94.51 LED146.2
N$141
  Top 0.254: LED148.4 150.39,86.89 LED147.2
N$142
  Top 0.254: LED141.4 125.5,133.12 LED140.2
N$143
  Top 0.254: LED150.4 150.64,71.65 LED149.2
N$144
  Top 0.254: LED151.4 149.63,64.03 LED150.2
N$145
  Top 0.254: LED152.4 147.85,56.66 LED151.2
N$146
  Top 0.254: LED153.4 145.06,49.81 LED152.2
N$147
  Top 0.254: LED154.4 141.75,42.69 LED153.2
N$148
  Top 0.254: LED155.4 137.69,36.09 LED154.2
N$149
  Top 0.254: LED156.4 133.12,30.25 LED155.2
N$150
  Top 0.254: LED149.4 150.9,79.27 LED148.2
N$151
  Top 0.254: LED158.4 121.94,19.83 LED157.2
N$152
  Top 0.254: LED159.4 115.59,15.52 LED158.2
N$153
  Top 0.254: LED160.4 108.99,11.96 LED159.2
N$154
  Top 0.254: LED161.4 101.88,9.17 LED160.2
N$155
  Top 0.254: LED162.4 94.51,7.13 LED161.2
N$156
  Top 0.254: LED163.4 86.89,5.61 LED162.2
N$157
  Top 0.254: LED164.4 79.27,5.1 LED163.2
N$158
  Top 0.254: LED157.4 127.78,24.91 LED156.2
N$159
  Top 0.254: LED166.4 64.28,6.37 LED165.2
N$160
  Top 0.254: LED167.4 56.92,8.4 LED166.2
N$161
  Top 0.254: LED168.4 49.81,10.94 LED167.2
N$162
  Top 0.254: LED169.4 42.95,14.25 LED168.2
N$163
  Top 0.254: LED170.4 36.34,18.31 LED169.2
N$164
  Top 0.254: LED171.4 30.5,22.88 LED170.2
N$165
  Top 0.254: LED172.4 24.91,28.22 LED171.2
N$166
  Top 0.254: LED165.4 71.9,5.36 LED164.2
N$167
  Top 0.254: LED174.4 15.77,40.15 LED173.2
N$168
  Top 0.254: LED175.4 12.21,47.01 LED174.2
N$169
  Top 0.254: LED176.4 9.42,53.87 LED175.2
N$170
  Top 0.254: LED177.4 7.13,61.49 LED176.2
N$171
  Top 0.254: LED178.4 5.86,68.6 LED177.2
N$172
  Top 0.254: LED179.4 5.1,76.73 LED178.2
N$173
  Top 0.254: LED180.4 5.61,84.1 LED179.2
N$174
  Top 0.254: LED173.4 19.83,34.06 LED172.2
N$175
  Top 0.254: LED182.4 8.4,99.08 LED181.2
N$176
  Top 0.254: LED183.4 10.94,106.19 LED182.2
N$177
  Top 0.254: LED184.4 14.25,113.05 LED183.2
N$178
  Top 0.254: LED185.4 18.31,119.66 LED184.2
N$179
  Top 0.254: LED186.4 22.88,125.5 LED185.2
N$180
  Top 0.254: LED187.4 28.22,131.09 LED186.2
N$181
  Top 0.254: LED188.4 33.8,135.91 LED187.2
N$182
  Top 0.254: LED181.4 6.37,91.72 LED180.2
N$183
  Top 0.254: LED190.4 47.01,143.79 LED189.2
N$184
  Top 0.254: LED191.4 53.87,146.58 LED190.2
N$185
  Top 0.254: LED192.4 70.13,152.42 62.25,150.14 61.49,148.87 LED191.2
N$186  (via drill 0.4)
  Top 0.254: LED8.2 69.02,85.53 v72.92,89.43
  Bottom 0.254: v72.92,89.43 74.19,90.7 PAD4.1
N$187  (via drill 0.4)
  Top 0.254: LED49.4 80.4,101.74 v80.54,101.88
  Bottom 0.254: v80.54,101.88 81.56,101.88 81.81,101.62 PAD5.1
N$188  (via drill 0.4)
  Top 0.254: v72.92,98.57 67.08,95.02 LED60.2
  Bottom 0.254: PAD8.1 v72.92,98.57
N$189  (via drill 0.4)
  Top 0.254: LED24.2 65.55,103.91 v66.32,104.42
  Bottom 0.254: v66.32,104.42 PAD12.1
N$190
  Top 0.254: LED189.4 40.15,140.23 LED188.2
N$191  (via drill 0.4)
  Top 0.254: v67.33,114.58 LED48.2
  Bottom 0.254: PAD16.1 v67.33,114.58
N$192  (via drill 0.4)
  Top 0.254: v68.09,124.23 LED92.2
  Bottom 0.254: PAD20.1 v68.09,124.23
N$193  (via drill 0.4)
  Top 0.254: v69.62,150.64 LED192.2
  Bottom 0.254: PAD24.1 v69.62,150.64
N$194  (via drill 0.4)
  Top 0.254: v68.09,135.4 LED132.2
  Bottom 0.254: PAD28.1 v68.09,135.4
N$195  (via drill 0.4)
  Top 0.254: LED9.4 80.4,110.37 v81.05,111.02
  Bottom 0.254: v81.05,111.02 81.56,110.77 81.81,110.51 PAD9.1
N$196  (via drill 0.4)
  Top 0.254: LED25.4 80.4,119.52 80.79,119.91 v81.05,119.91
  Bottom 0.254: v81.05,119.91 81.56,119.91 81.81,119.66 PAD13.1
N$197  (via drill 0.4)
  Top 0.254: LED61.4 80.4,128.41 80.54,128.55 v81.3,129.05
  Bottom 0.254: v81.3,129.05 81.81,128.55 PAD17.1
N$198  (via drill 0.4)
  Top 0.254: LED133.4 80.4,154.57 80.79,154.96 v81.05,154.96
  Bottom 0.254: v81.05,154.96 81.3,154.96 81.81,154.45 PAD21.1
N$199  (via drill 0.4)
  Top 0.254: LED93.4 80.4,139.33 v81.05,139.98
  Bottom 0.254: v81.05,139.98 81.56,139.72 81.81,139.47 PAD25.1

## Text on the board
bPlace: DO | GND | 5V | DI | DO | GND | 5V | DI | DO | GND | 5V | DI | DO | GND | 5V | DI | DO | GND | 5V | DI | DO | GND | 5V | DI | DO | GND | 5V | DI | WS2812B RGB-Ring - 8 | WS2812B RGB-Ring - 12 | www.watterott.com | WS2812B RGB-Ring - 60 | WS2812B RGB-Ring - 40 | WS2812B RGB-Ring - 32 | WS2812B RGB-lRing - 24 | WS2812B RGB-Ring - 16 | www.watterott.com | www.watterott.com | www.watterott.com | www.watterott.com | www.watterott.com | www.watterott.com